# Altium schematic sheet Motors.SchDoc
size A
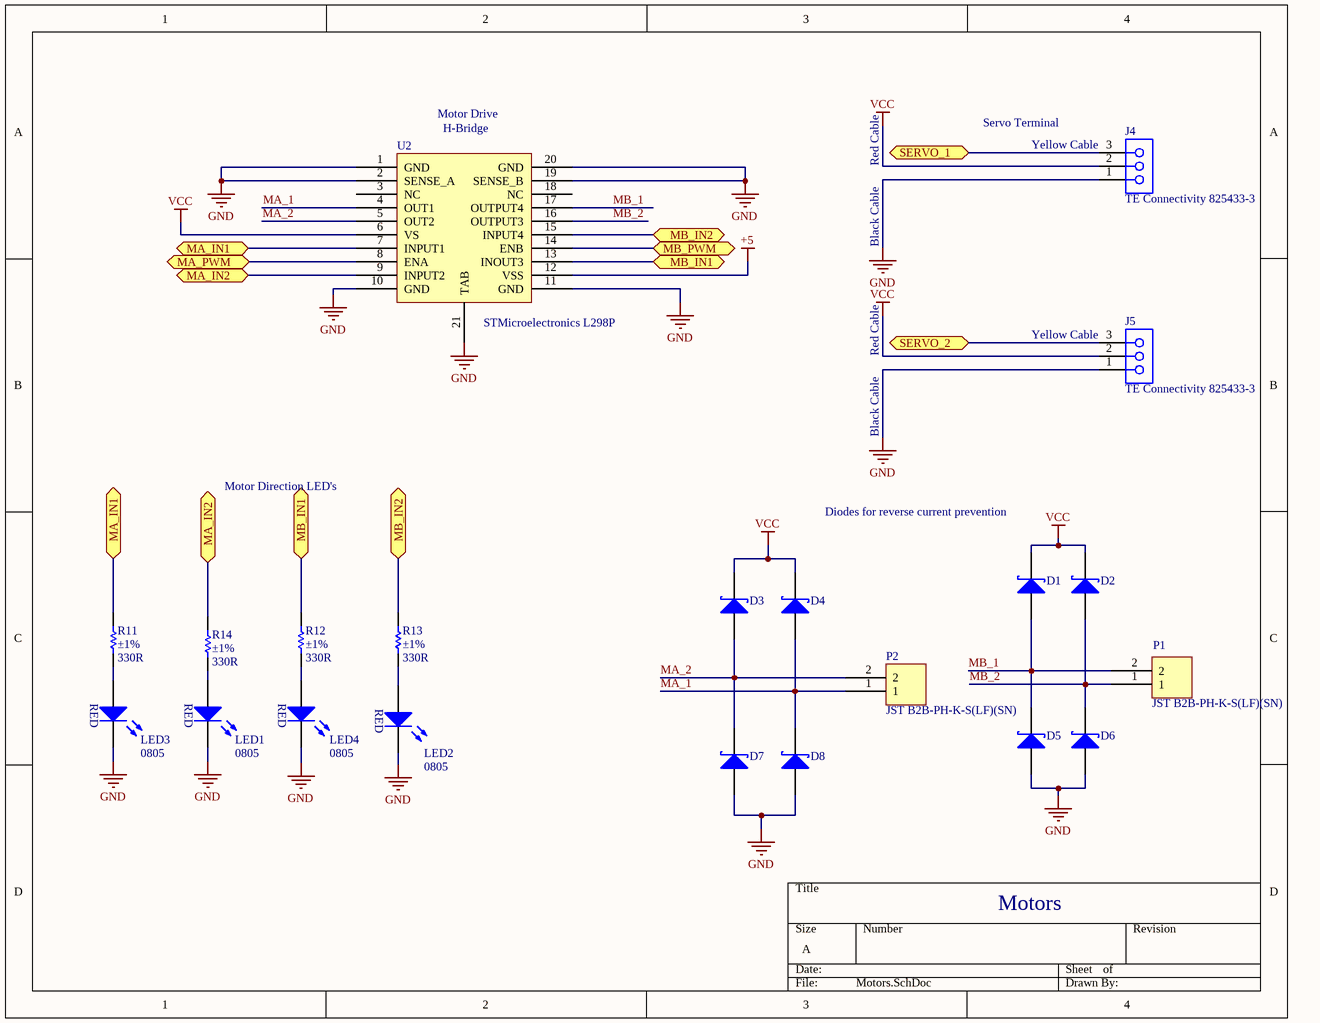
[diagram p0: Motors.SchDoc]

## Parts
D1  SS34 SMA DO-214AC  [SMA]  (value not drawn)
D2  SS34 SMA DO-214AC  [SMA]  (value not drawn)
D3  SS34 SMA DO-214AC  [SMA]  (value not drawn)
D4  SS34 SMA DO-214AC  [SMA]  (value not drawn)
D5  SS34 SMA DO-214AC  [SMA]  (value not drawn)
D6  SS34 SMA DO-214AC  [SMA]  (value not drawn)
D7  SS34 SMA DO-214AC  [SMA]  (value not drawn)
D8  SS34 SMA DO-214AC  [SMA]  (value not drawn)
J4  TE Connectivity 825433-3  [PCB-43x6b8o6d5mxbq35c0sh-1]
J5  TE Connectivity 825433-3  [PCB-43x6b8o6d5mxbq35c0sh-1]
LED1  Case/Package: 0805  [LED0805]  (hidden comment: CMP-7f15b6173d91a0d2-5)
LED2  Case/Package: 0805  [LED0805]  (hidden comment: CMP-7f15b6173d91a0d2-5)
LED3  Case/Package: 0805  [LED0805]  (hidden comment: CMP-7f15b6173d91a0d2-5)
LED4  Case/Package: 0805  [LED0805]  (hidden comment: CMP-7f15b6173d91a0d2-5)
P1  JST B2B-PH-K-S(LF)(SN)  [PCB-gpdi66yn1jko56crxrq7-1]
P2  JST B2B-PH-K-S(LF)(SN)  [PCB-gpdi66yn1jko56crxrq7-1]
R11  Resistance Tolerance: ±1%  Resistance: 330R  [PCB-4097432-1]  (hidden comment: Bourns CR0805-FX-4701GLF)
R12  Resistance Tolerance: ±1%  Resistance: 330R  [PCB-4097432-1]  (hidden comment: Bourns CR0805-FX-4701GLF)
R13  Resistance Tolerance: ±1%  Resistance: 330R  [PCB-4097432-1]  (hidden comment: Bourns CR0805-FX-4701GLF)
R14  Resistance Tolerance: ±1%  Resistance: 330R  [PCB-4097432-1]  (hidden comment: Bourns CR0805-FX-4701GLF)
U2  STMicroelectronics L298P  [L298PSOIC127P1420X360-20N]

## Ports
MA_IN1 (bidir), MA_IN2 (bidir), MA_PWM (bidir), MB_IN1 (bidir), MB_IN2 (bidir), MB_PWM (bidir), SERVO_1 (bidir), SERVO_2 (bidir)

## Nets
+5: U2.12(VSS)
GND: D5.1(A) D6.1(A) D7.1(A) D8.1(A) J4.1 J5.1 LED1.1(K) LED2.1(K) LED3.1(K) LED4.1(K) U2.1(GND) U2.2(SENSE_A) U2.10(GND) U2.11(GND) U2.19(SENSE_B) U2.20(GND) U2.21(TAB)
VCC: D1.2(K) D2.2(K) D3.2(K) D4.2(K) J4.2 J5.2 U2.6(VS)
MA_1: D4.1(A) D8.2(K) P2.1 U2.4(OUT1)
MA_2: D3.1(A) D7.2(K) P2.2 U2.5(OUT2)
MA_IN1: R11.2 U2.7(INPUT1) ; port MA_IN1
MA_IN2: R14.2 U2.9(INPUT2) ; port MA_IN2
MA_PWM: U2.8(ENA) ; port MA_PWM
MB_1: D1.1(A) D5.2(K) P1.2 U2.17(OUTPUT4)
MB_2: D2.1(A) D6.2(K) P1.1 U2.16(OUTPUT3)
MB_IN1: R12.2 U2.13(INOUT3) ; port MB_IN1
MB_IN2: R13.2 U2.15(INPUT4) ; port MB_IN2
MB_PWM: U2.14(ENB) ; port MB_PWM
SERVO_1: J4.3 ; port SERVO_1
SERVO_2: J5.3 ; port SERVO_2
NetLED1_2: LED1.2(A) R14.1
NetLED2_2: LED2.2(A) R13.1
NetLED3_2: LED3.2(A) R11.1
NetLED4_2: LED4.2(A) R12.1

Not connected (* = marked no-connect by the designer): U2 3(NC) 18(NC)

## Notes on the sheet
- (near U2) Motor Drive
- (near U2) H-Bridge
- Red Cable
- Servo Terminal
- (near J4) Yellow Cable
- Black Cable
- (near J5) Yellow Cable
- Motor Direction LED's
- Diodes for reverse current prevention
- Motors
- (in symbol CMP-7f15b6173d91a0d2-5) RED

## Library data of the parts
D1-D8 = CMP-cx3sevj7k2ks0umzedmk-1: A Schotty Barrier Rectifier; CustomComponentID: cx3sevj7k2ks0umzedmk
J4 J5 = CMP-52d299a8d8748d15-5: Pin header; pin strips; AMPMODU MOD II; male; PIN: 3; straight; ELV Compliant: Compliant; Pin Pitch: 0.00254 m; Number of Contacts: 3; Current Rating: 3.0 A; Housing Color: Green; OctopartID: 52d299a8d8748d15; REACH SVHC Compliance: No SVHC; Flammability Rating: UL 94 V-0; Orientation: Vertical; Lifecycle Status: Active; Octopart URL: http://octopart.com/825433-3-te+connectivity-40939456; Housing Material: Polyester; Packaging: Box; Contact Plating: Gold, Gold over Nickel, Tin, Tin over Nickel; Gender: Male; Manufacturer Part Number: 825433-3; Mounting Style: PCB; Contact Material: Brass; RoHS: Compliant
LED1-LED4 = CMP-7f15b6173d91a0d2-5: LED; SMD; 0805; red; 7.2-17mcd; 2x1.25mm; 170°; 1.8÷2.6V; 20mA; Manufacturer Part Number: HSMH-C170; Lead-Free Status: Lead Free; Lens Type: Diffused; Power Dissipation: 0.065 W; Voltage Rating (DC): 1.8 V; Luminous Intensity: 0.017 cd; Lens Color: Clear; Peak Wavelength: 6.6e-07 m; Wavelength: 6.39e-07 m; Case/Package (SI): 2012; RoHS: Compliant; Number of Pins: 2; Forward Voltage: 1.8 V; Packaging: Cut Tape (CT); Viewing Angle: 170 °; Octopart URL: http://octopart.com/hsmh-c170-avago-550882; REACH SVHC Compliance: No SVHC; Order Code (RS Components): 486-0468; Color: Red; OctopartID: 7f15b6173d91a0d2; Lifecycle Status: Active; Mounting Style: Surface Mount, Vertical; Part Description: *
P1 P2 = CMP-642947-5: PH Series 2 Position 2 mm Pitch Through Hole Top Entry Shrouded Header; Number of Positions: 2; Pin Pitch: 2.00 mm; Current Rating: 2.00 A; Insulation Resistance: 1.00 MΩ; Gender: Male; Lead-Free Status: Lead Free; Voltage Rating (AC): 100 V; Contact Resistance: 10.0 mΩ; Packaging: Bulk; RoHS: Compliant; REACH SVHC Compliance: No SVHC; Size-Length: 5.90 mm; OctopartID: a21c6b154b5e7ddb; Octopart URL: http://octopart.com/b2b-ph-k-s%28lf%29%28sn%29-jst-248868; Size-Height: 6.00 mm; Housing Material: Nylon; Size-Width: 4.50 mm; Mounting Style: Through Hole, Vertical; Manufacturer Part Number: B2B-PH-K-S(LF)(SN); Number of Rows: 1; Contact Material: Brass; Housing Color: Natural; Number of Contacts: 2; Contact Plating: Tin
R11-R14 = CMP-97505e06006c4897-1: Res Thick Film 0805 4.7K Ohm 1% 1/8W ±100ppm/°C Molded SMD SMD Paper Tape on Plastic Reel; Voltage Rating (DC): 150 V; Power Rating: 125 mW; Manufacturer Part Number: CR0805-FX-4701GLF; REACH SVHC Compliance: No SVHC; OctopartID: 97505e06006c4897; Packaging: Tape & Reel (TR), Cut Tape (CT); Octopart URL: http://octopart.com/cr0805-fx-4701glf-bourns-6074970; Number of Pins: 2; Mounting Style: Surface Mount; RoHS: Compliant; Size-Thickness: 508 µm; Size-Length: 2.01 mm; Case/Package: 0805; Size-Width: 1.24 mm
U2 = CMP-1433026-16: L298 Series Dual Full Bridge 4 A 46 V Driver Surface Mount - PowerSO-20; Lead-Free Status: Lead Free; Supply Voltage (DC): 46.0 V (max); Number of Channels: 2; Manufacturer Part Number: L298P; Mounting Style: Surface Mount; Octopart URL: http://octopart.com/l298p-stmicroelectronics-468197; Packaging: Tube; RoHS: Compliant; Lifecycle Status: Active; OctopartID: b6bd7fb0b73e697a